# Altium schematic sheet SDRAM.SchDoc
size A4
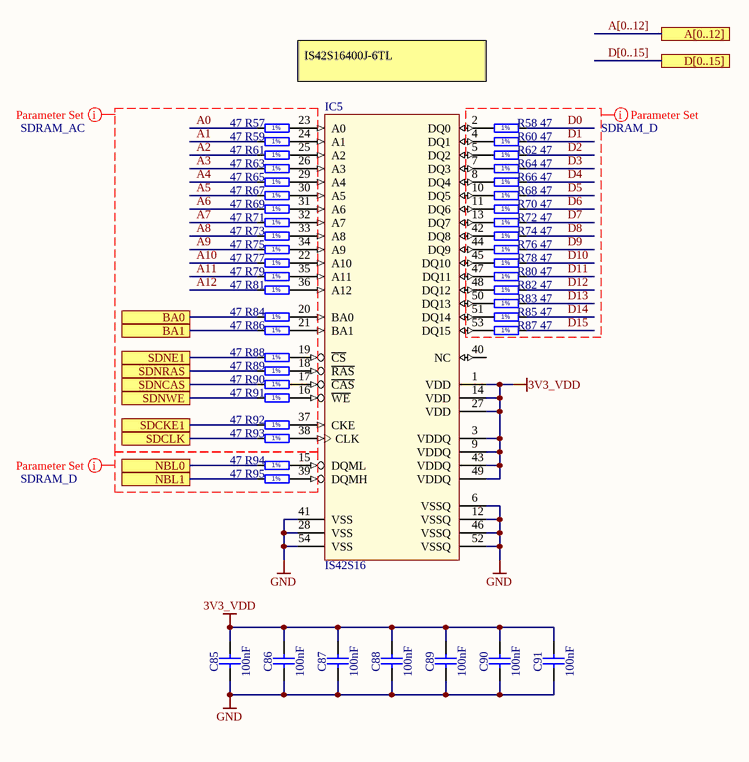
[diagram p0: SDRAM.SchDoc]

## Parts
C85  100nF  [CAPC1005X55N]
C86  100nF  [CAPC1005X55N]
C87  100nF  [CAPC1005X55N]
C88  100nF  [CAPC1005X55N]
C89  100nF  [CAPC1005X55N]
C90  100nF  [CAPC1005X55N]
C91  100nF  [CAPC1005X55N]
IC5  IS42S16  [TSOP-54]
R57  47  [RESC1005X40N]
R58  47  [RESC1005X40N]
R59  47  [RESC1005X40N]
R60  47  [RESC1005X40N]
R61  47  [RESC1005X40N]
R62  47  [RESC1005X40N]
R63  47  [RESC1005X40N]
R64  47  [RESC1005X40N]
R65  47  [RESC1005X40N]
R66  47  [RESC1005X40N]
R67  47  [RESC1005X40N]
R68  47  [RESC1005X40N]
R69  47  [RESC1005X40N]
R70  47  [RESC1005X40N]
R71  47  [RESC1005X40N]
R72  47  [RESC1005X40N]
R73  47  [RESC1005X40N]
R74  47  [RESC1005X40N]
R75  47  [RESC1005X40N]
R76  47  [RESC1005X40N]
R77  47  [RESC1005X40N]
R78  47  [RESC1005X40N]
R79  47  [RESC1005X40N]
R80  47  [RESC1005X40N]
R81  47  [RESC1005X40N]
R82  47  [RESC1005X40N]
R83  47  [RESC1005X40N]
R84  47  [RESC1005X40N]
R85  47  [RESC1005X40N]
R86  47  [RESC1005X40N]
R87  47  [RESC1005X40N]
R88  47  [RESC1005X40N]
R89  47  [RESC1005X40N]
R90  47  [RESC1005X40N]
R91  47  [RESC1005X40N]
R92  47  [RESC1005X40N]
R93  47  [RESC1005X40N]
R94  47  [RESC1005X40N]
R95  47  [RESC1005X40N]

## Ports
A[0..12], BA0, BA1, D[0..15], NBL0, NBL1, SDCKE1, SDCLK, SDNCAS, SDNE1, SDNRAS, SDNWE

## Nets
3V3_VDD: C85.2 C86.2 C87.2 C88.2 C89.2 C90.2 C91.2 IC5.1(VDD) IC5.3(VDDQ) IC5.9(VDDQ) IC5.14(VDD) IC5.27(VDD) IC5.43(VDDQ) IC5.49(VDDQ)
GND: C85.1 C86.1 C87.1 C88.1 C89.1 C90.1 C91.1 IC5.6(VSSQ) IC5.12(VSSQ) IC5.28(VSS) IC5.41(VSS) IC5.46(VSSQ) IC5.52(VSSQ) IC5.54(VSS)
A0: R57.2
A1: R59.2
A2: R61.2
A3: R63.2
A4: R65.2
A5: R67.2
A6: R69.2
A7: R71.2
A8: R73.2
A9: R75.2
A10: R77.2
A11: R79.2
A12: R81.2
BA0: R84.2 ; port BA0
BA1: R86.2 ; port BA1
D0: R58.2
D1: R60.2
D2: R62.2
D3: R64.2
D4: R66.2
D5: R68.2
D6: R70.2
D7: R72.2
D8: R74.2
D9: R76.2
D10: R78.2
D11: R80.2
D12: R82.2
D13: R83.2
D14: R85.2
D15: R87.2
NBL0: R94.2 ; port NBL0
NBL1: R95.2 ; port NBL1
SDCKE1: R92.2 ; port SDCKE1
SDCLK: R93.2 ; port SDCLK
SDNCAS: R90.2 ; port SDNCAS
SDNE1: R88.2 ; port SDNE1
SDNRAS: R89.2 ; port SDNRAS
SDNWE: R91.2 ; port SDNWE
NetIC5_2: IC5.2(DQ0) R58.1
NetIC5_4: IC5.4(DQ1) R60.1
NetIC5_5: IC5.5(DQ2) R62.1
NetIC5_7: IC5.7(DQ3) R64.1
NetIC5_8: IC5.8(DQ4) R66.1
NetIC5_10: IC5.10(DQ5) R68.1
NetIC5_11: IC5.11(DQ6) R70.1
NetIC5_13: IC5.13(DQ7) R72.1
NetIC5_15: IC5.15(DQML) R94.1
NetIC5_16: IC5.16(~{WE}) R91.1
NetIC5_17: IC5.17(~{CAS}) R90.1
NetIC5_18: IC5.18(~{RAS}) R89.1
NetIC5_19: IC5.19(~{CS}) R88.1
NetIC5_20: IC5.20(BA0) R84.1
NetIC5_21: IC5.21(BA1) R86.1
NetIC5_22: IC5.22(A10) R77.1
NetIC5_23: IC5.23(A0) R57.1
NetIC5_24: IC5.24(A1) R59.1
NetIC5_25: IC5.25(A2) R61.1
NetIC5_26: IC5.26(A3) R63.1
NetIC5_29: IC5.29(A4) R65.1
NetIC5_30: IC5.30(A5) R67.1
NetIC5_31: IC5.31(A6) R69.1
NetIC5_32: IC5.32(A7) R71.1
NetIC5_33: IC5.33(A8) R73.1
NetIC5_34: IC5.34(A9) R75.1
NetIC5_35: IC5.35(A11) R79.1
NetIC5_36: IC5.36(A12) R81.1
NetIC5_37: IC5.37(CKE) R92.1
NetIC5_38: IC5.38(CLK) R93.1
NetIC5_39: IC5.39(DQMH) R95.1
NetIC5_42: IC5.42(DQ8) R74.1
NetIC5_44: IC5.44(DQ9) R76.1
NetIC5_45: IC5.45(DQ10) R78.1
NetIC5_47: IC5.47(DQ11) R80.1
NetIC5_48: IC5.48(DQ12) R82.1
NetIC5_50: IC5.50(DQ13) R83.1
NetIC5_51: IC5.51(DQ14) R85.1
NetIC5_53: IC5.53(DQ15) R87.1

Not connected (* = marked no-connect by the designer): IC5 40(NC)

## Buses and harness runs
bus A[0..12] = port A[0..12]
bus D[0..15] = port D[0..15]

## Layout directives
net class SDRAM_AC: A0, A1, A2, A3, A4, A5, A6, A7, A8, A9, A10, A11, A12
net class SDRAM_D: (no net found under the mark), D0, D1, D2, D3, D4, D5, D6, D7, D8, D9, D10, D11, D12, D13, D14, D15

## Notes on the sheet
- IS42S16400J-6TL
- (in symbol R0402_47R_1%_0.0625W_100PPM) 1%

## Library data of the parts
C85-C91 = CC0402_100NF_16V_10%_X5R: Non-polarised capacitor; Part Description: SMD Multilayer Chip Ceramic Capacitor; Manufacturer: GENERIC; Manufacturer1 Part Number: GRM155R61C104KA88D; Voltage: 16V; TC: X5R; Tolerance: ±10%; Part Number: CC0402_100NF_16V_10%_X5R; Component Kind: Standard; Component Type: Standard; Pin Count: 2; Value: 100nF; Status: None; Manufacturer Part Number: CC0402_100NF_16V_10%_X5R; Case: 0402; Mounted: Yes; Socket: No; SMD: Yes; Sense: No; Manufacturer1 Example: MURATA; Manufacturer1 ComponentHeight: 0.55mm; HelpURL: \\cern.ch\dfs\Applications\Altium\Datasheets\CC0402_X5R_MURATA_GRM.pdf; Author: CERN DEM JLC; CreateDate: 2013-12-10; LatestRevisionDate: 2013-12-10
IC5 = IS42S16: SDRAM 64m 200mhz 54tsop; MP: IS42S16400J-5TL-TR; MF: ISSI; Availability: Unavailable; Package: TSOP-54 ISSI; Price: 1.24 USD; Value: *
R57-R95 = R0402_47R_1%_0.0625W_100PPM: Resistor - 1%; Part Description: General Purpose Thick Film Chip Resistor; Manufacturer: GENERIC; Manufacturer1 Part Number: 232270674709L; TC: ±100ppm/°C; Part Number: R0402_47R_1%_0.0625W_100PPM; Component Kind: Standard; Component Type: Standard; Pin Count: 2; Value: 47; Status: Not recommended; Power: 0.0625W; Tolerance: ±1%; Manufacturer Part Number: R0402_47R_1%_0.0625W_100PPM; Case: 0402; Mounted: Yes; Sense: No; Socket: No; SMD: Yes; Manufacturer1 Example: YAGEO PHYCOMP; Manufacturer1 ComponentHeight: 0.4mm; HelpURL: \\cern.ch\dfs\Applications\Altium\Datasheets\R0402_Phycomp_RC0402.pdf; Author: CERN DEM JLC; CreateDate: 2007-12-03; LatestRevisionDate: 2012-10-17